# Altium project bio_lamp.PrjPcb
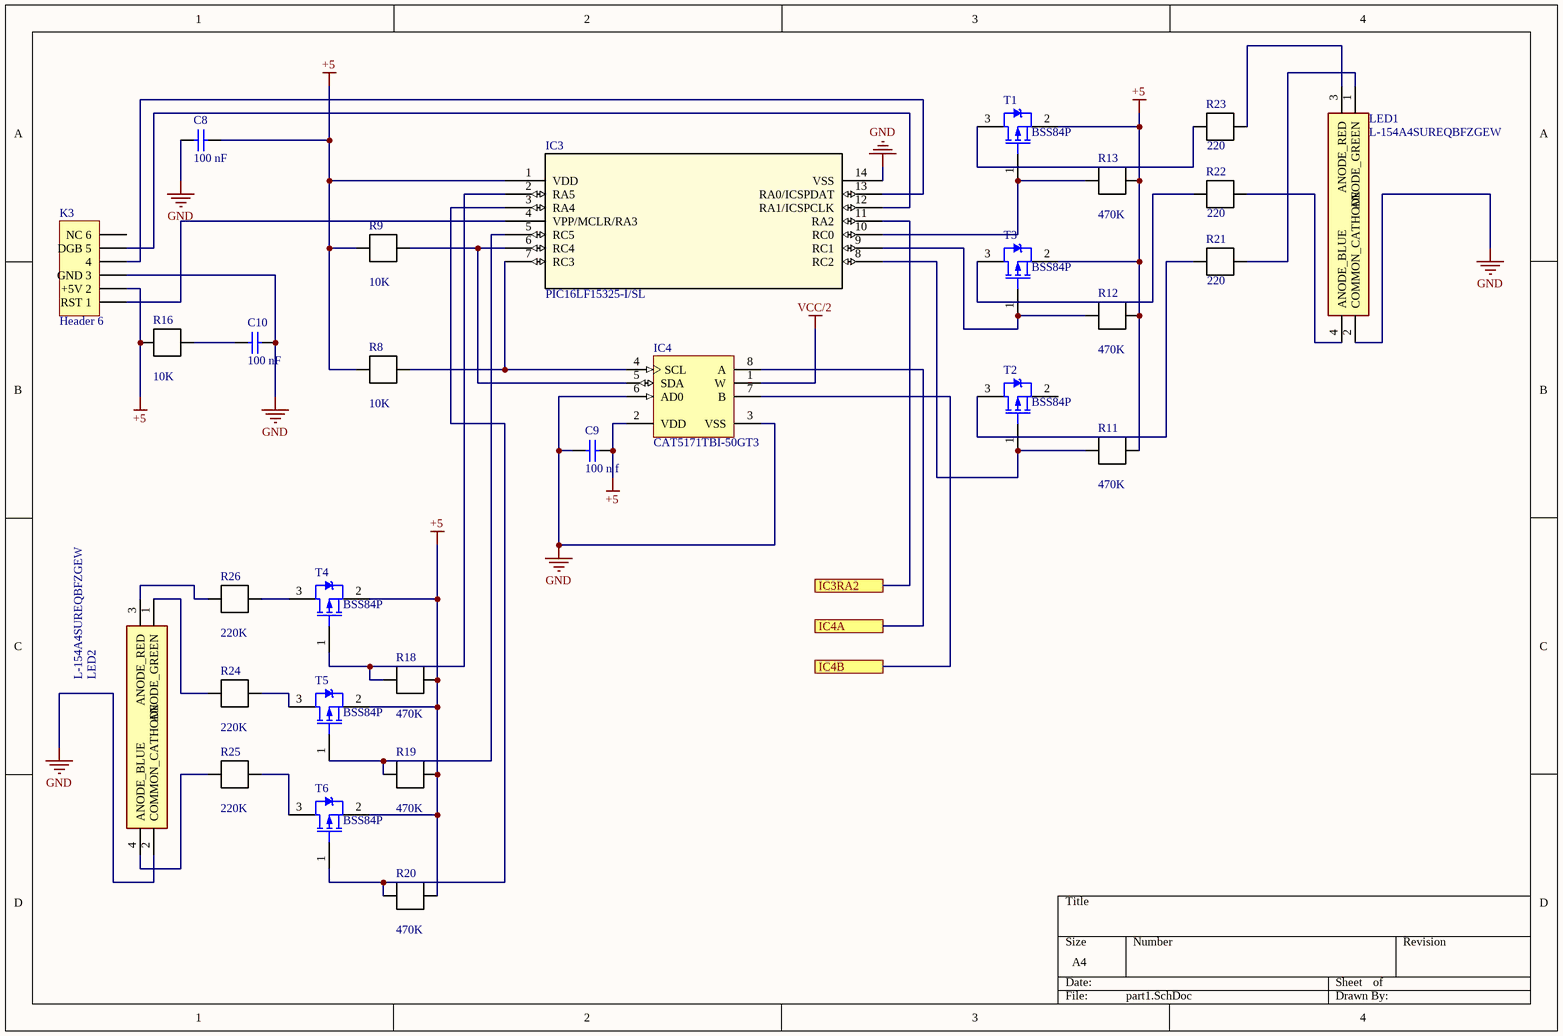
[diagram p0: part1.SchDoc]
2 sheets, 50 parts. Net scope: flat (ports and power ports of the same name join across sheets).
Board file: print1.PcbDoc
Sheets:
  part1.SchDoc
  part2.SchDoc

## Sheet part1.SchDoc
size A4; SheetNumber: 1; SheetTotal: 2

### Parts
C8  100 nF  [CAPC2013X70X45NL10T25]
C9  100 n f  [CAPC2013X70X45NL10T25]
C10  100 nF  [CAPC2013X70X45NL10T25]
IC3  PIC16LF15325-I/SL  [SOIC14_SL_MCH]
IC4  CAT5171TBI-50GT3  [ONSC-SOT23-8-527AK-01_N]
K3  Header 6  [HDR1X6]
LED1  L-154A4SUREQBFZGEW  [L-154A4SUREQBFZGEC]
LED2  L-154A4SUREQBFZGEW  [L-154A4SUREQBFZGEC]
R8  value 10K  [6-0805_M]
R9  value 10K  [6-0805_M]
R11  value 470K  [C1206]
R12  value 470K  [C1206]
R13  value 470K  [C1206]
R16  value 10K  [6-0805_M]
R18  value 470K  [C1206]
R19  value 470K  [C1206]
R20  value 470K  [C1206]
R21  value 220  [C1206]
R22  value 220  [C1206]
R23  value 220  [C1206]
R24  value 220K  [C1206]
R25  value 220K  [C1206]
R26  value 220K  [C1206]
T1  BSS84P  [INF-PG-SOT23_N]
T2  BSS84P  [INF-PG-SOT23_N]
T3  BSS84P  [INF-PG-SOT23_N]
T4  BSS84P  [INF-PG-SOT23_N]
T5  BSS84P  [INF-PG-SOT23_N]
T6  BSS84P  [INF-PG-SOT23_N]

### Ports
IC3RA2, IC4A, IC4B

### Nets
+5: C8.2 C9.2 IC3.1(VDD) IC4.2(VDD) K3.2(+5V_2) R8.1 R9.1 R11.2 R12.2 R13.2 R16.1 R18.2 R19.2 R20.2 T1.2(SOURCE) T3.2(SOURCE) T4.2(SOURCE) T5.2(SOURCE) T6.2(SOURCE)
GND: C8.1 C9.1 C10.2 IC3.14(VSS) IC4.3(VSS) IC4.6(AD0) K3.3(GND_3) LED1.2(COMMON_CATHODE) LED2.2(COMMON_CATHODE)
VCC/2: IC4.1(W)
NetC3_1: IC3.11(RA2) ; port IC3RA2
NetC10_1: C10.1 R16.2
NetIC2_1: IC4.8(A) ; port IC4A
NetIC2_5: IC4.7(B) ; port IC4B
NetIC3_2: IC3.2(RA5) R18.1 T4.1(GATE)
NetIC3_3: IC3.3(RA4) R20.1 T6.1(GATE)
NetIC3_4: IC3.4(VPP/MCLR/RA3) K3.1(RST_1)
NetIC3_5: IC3.5(RC5) R19.1 T5.1(GATE)
NetIC3_6: IC3.6(RC4) IC4.5(SDA) R9.2
NetIC3_7: IC3.7(RC3) IC4.4(SCL) R8.2
NetIC3_8: IC3.8(RC2) R11.1 T2.1(GATE)
NetIC3_9: IC3.9(RC1) R12.1 T3.1(GATE)
NetIC3_10: IC3.10(RC0) R13.1 T1.1(GATE)
NetIC3_12: IC3.12(RA1/ICSPCLK) K3.5(DGB_5)
NetIC3_13: IC3.13(RA0/ICSPDAT) K3.4
NetLED1_1: LED1.1(ANODE_GREEN) R21.2
NetLED1_3: LED1.3(ANODE_RED) R23.2
NetLED1_4: LED1.4(ANODE_BLUE) R22.2
NetLED2_1: LED2.1(ANODE_GREEN) R24.1
NetLED2_3: LED2.3(ANODE_RED) R26.1
NetLED2_4: LED2.4(ANODE_BLUE) R25.1
NetR21_1: R21.1 T2.3(DRAIN)
NetR22_1: R22.1 T3.3(DRAIN)
NetR23_1: R23.1 T1.3(DRAIN)
NetR24_2: R24.2 T5.3(DRAIN)
NetR25_2: R25.2 T6.3(DRAIN)
NetR26_2: R26.2 T4.3(DRAIN)

Not connected (* = marked no-connect by the designer): K3 6(NC_6); T2 2(SOURCE)

### Library data of the parts
C8-C10 = CMP-2007-00889-1: Manufacturer: Murata; Part Number: GRM2165C1H332JA01D
IC3 = PIC16LF15325-I/SL: No Description Available; Vendor: Microchip; Built_By: EMA_Cory; SourceLibrary: Microchip_2020-03-04; Datasheet: http://ww1.microchip.com/downloads/en/DeviceDoc/PIC16-L-F15325-45-Data-Sheet-40001865D.pdf; Manufacturer_Part_Number: PIC16LF15325-I/SL; Copyright: Copyright (C) 2018 Accelerated Designs. All rights reserved; RefDes: RefDes; Type: DEV
IC4 = CMP-1317-00202-1: 256-Position I2C Compatible Digital Potentiometer (POT), -40 to 85 degC, 8-Pin SOT23, Pb-Free, Tape and Reel; Manufacturer: On Semiconductor; # of Pots: 1; VDD Max (V): 5.5; # of Taps: 256; Code_JEDEC: MO-178; RoHS: TRUE; ComponentLink1URL: http://www.onsemi.com/; ComponentLink3URL: http://www.onsemi.com/pub_link/Collateral/527AK.PDF; PackageDescription: 8-Pin Small Outline Transistor, Body 2.9 x 1.6 mm, Pitch 0.65 mm; ComponentLink3Description: Package Specification; PackageReference: SOT23-8-527AK-01; ComponentLink1Description: Manufacturer URL; PartNumber: CAT5171TBI-50GT3; PackageVersion: Rev. A, 03/2009; Packing: Tape and Reel; DatasheetVersion: Rev. 2; Mounting Technology: Surface Mount; ComponentLink2URL: http://www.onsemi.com/pub_link/Collateral/CAT5171-D.PDF; Control Interface: I2C; Type: Potentiometer; ComponentLink2Description: Datasheet
K3 = Header 6: Header, 6-Pin; LatestRevisionDate: 17-Jul-2002; LatestRevisionNote: Re-released for DXP Platform.; Publisher: Altium Limited
LED1 LED2 = L-154A4SUREQBFZGEW: LED; Manufacturer_Name: Kingbright; Datasheet Link: http://www.kingbright.com/attachments/file/psearch/000/00/00/L-154A4SUREQBFZGEW(Ver.11A).pdf; Manufacturer_Part_Number: L-154A4SUREQBFZGEW; Mouser Part Number: N/A; Mouser Price/Stock: https://www.mouser.co.uk/ProductDetail/Kingbright/L-154A4SUREQBFZGEW?qs=2JU0tDl2GZ3s0DU5fkfHGQ%3D%3D
R8 R9 R11-R13 R16 R18-R26 = Res1: Resistor; Published: 8-Jun-2000; LatestRevisionDate: 17-Jul-2002; LatestRevisionNote: Re-released for DXP Platform.; PackageReference: AXIAL-0.3; Publisher: Altium Limited; PackageDescription: Axial Device, Thru-Hole; 2 Leads; 0.3 in Pin Spacing; Supplier 1: RSComponents
T1-T6 = CMP-1099-00028-1: P-Channel SIPMOS Small-Signal-Transistor, -60 V VDS, -0.17 A ID, -55 to 150 degC, PG-SOT23, Reel, Green; Manufacturer: Infineon; VGS(th) (max): -2Â V; VGS(th) (min): -1Â V; VDS (max): -60Â V; Rth: 350Â K/W; Pto t (max): 0.36Â W; ID (max): -0.17Â A; IDpuls (max): -0.68Â A; RDS (on) (max) (@4.5V): 12,000Â mOhm; QG: 1Â nC; Green: TRUE; RDS (on) (max): 8,000Â mOhm; ComponentLink3URL: http://www.infineon.com/dgdl/SOT23-Package_Overview.pdf?folderId=db3a30431936bc4b0119532290053c66&fileId=db3a30431936bc4b0119533468123c85; ComponentLink3Description: Package Specification; Packing: Reel; PartNumber: BSS84P; ComponentLink2Description: Datasheet; Mounting Technology: Surface Mount; ComponentLink2URL: http://www.infineon.com/dgdl/BSS84P_Rev2.7%5B1%5D.pdf?folderId=db3a304314dca38901154a72e3951a65&fileId=db3a304330f68606013118ac7a9b4549; PackageReference: PG-SOT23; ComponentLink1URL: http://www.infineon.com/; PackageVersion: Apr-08; ComponentLink1Description: Manufacturer URL; PackageDescription: 3-Pin Small Outline Transistor Package, 2.9 x 1.3 mm Body, 0.95 mm Pitch; Halogen-free: TRUE; DatasheetVersion: Rev. 2.7

## Sheet part2.SchDoc
size A4; SheetNumber: 2; SheetTotal: 2
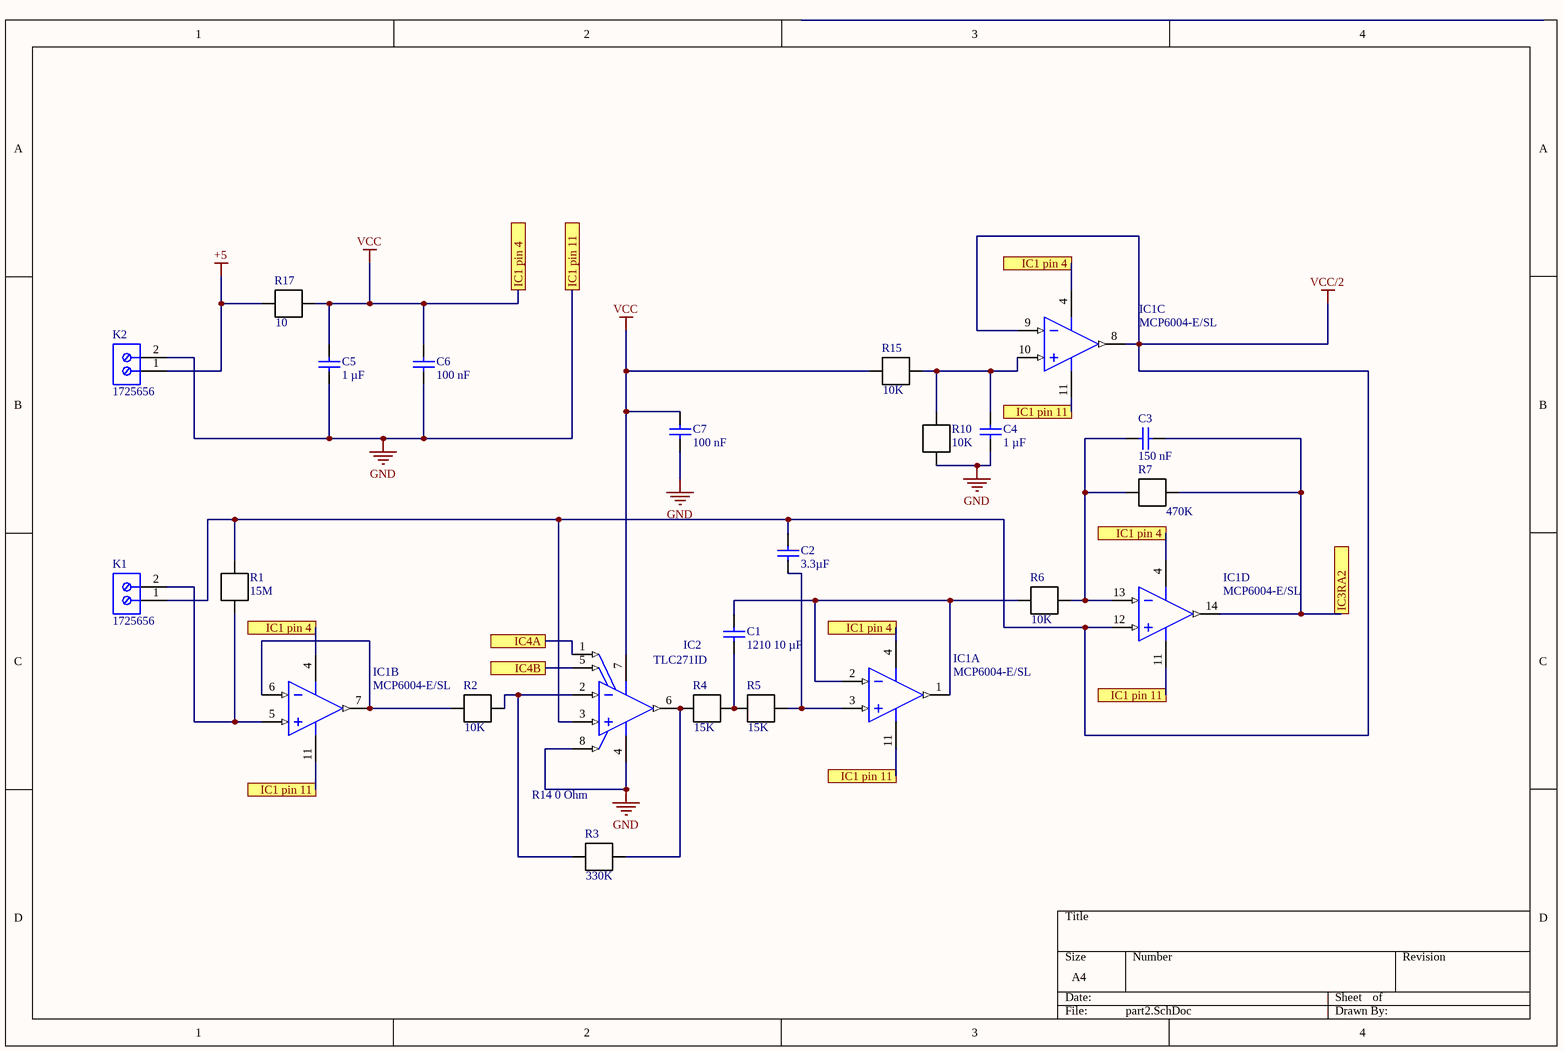
[diagram p1: part2.SchDoc]

### Parts
C1  1210 10 µF  [CAPC3225X279X50LL20T25]
C2  3.3µF  [CAPC1210(3225)280_N]
C3  150 nF  [CAPC2013X70X45NL10T25]
C4  1 µF  [CAPC2013X70X45NL10T25]
C5  1 µF  [CAPC2013X70X45NL10T25]
C6  100 nF  [CAPC2013X70X45NL10T25]
C7  100 nF  [CAPC2013X70X45NL10T25]
IC1  MCP6004-E/SL  [SOIC-SL14_M]  (parts A,B,C,D of 4)
IC2  TLC271ID  [D0008A_L]
K1  1725656  [PHOE-1725656-2]
K2  1725656  [PHOE-1725656-2]
R1  value 15M  [6-0805_M]
R2  value 10K  [6-0805_M]
R3  value 330K  [C1206]
R4  value 15K  [C1206]
R5  value 15K  [C1206]
R6  value 10K  [6-0805_M]
R7  value 470K  [C1206]
R10  value 10K  [6-0805_M]
R15  value 10K  [6-0805_M]
R17  value 10  [6-0805_M]

### Ports
IC1 pin 4, IC1 pin 11, IC3RA2, IC4A, IC4B

### Nets
+5: K2.1 R17.1
GND: C4.1 C5.1 C6.1 C7.1 IC1.11(VSS) IC2.4(GND) IC2.8(BIAS_SELECT) K2.2 R10.1 ; port IC1 pin 11
VCC: C5.2 C6.2 C7.2 IC1.4(VDD) IC2.7(VDD) R15.1 R17.2 ; port IC1 pin 4
VCC/2: C2.2 IC1.8(VOUTC) IC1.9(VINC-) IC1.12(VIND+) IC2.3(IN+) K1.1 R1.2
NetC1_1: C1.1 R4.2 R5.1
NetC1_2: C1.2 IC1.1(VOUTA) IC1.2(VINA-) R6.1
NetC2_1: C2.1 IC1.3(VINA+) R5.2
NetC3_1: C3.1 IC1.14(VOUTD) R7.2 ; port IC3RA2
NetC3_2: C3.2 IC1.13(VIND-) R6.2 R7.1
NetC4_2: C4.2 IC1.10(VINC+) R10.2 R15.2
NetIC1_5: IC1.5(VINB+) K1.2 R1.1
NetIC1_6: IC1.6(VINB-) IC1.7(VOUTB) R2.1
NetIC2_1: IC2.1(OFFSET_N1) ; port IC4A
NetIC2_2: IC2.2(IN-) R2.2 R3.1
NetIC2_5: IC2.5(OFFSET_N2) ; port IC4B
NetIC2_6: IC2.6(OUT) R3.2 R4.1

### Notes on the sheet
- R14 0 Ohm

### Library data of the parts
C1 = CMP-2000-05477-1: Chip Capacitor, 10 uF, +/- 10%, 25 V, -55 to 85 degC, 1210 (3225 Metric), RoHS, Tape and Reel; Manufacturer: AVX; Product Training Modules: ComponentSolutionsforSmartMeterApplications; Capacitance: 10µF; Catalog Drawings: AT2A_1210_2.79; Voltage - Rated: 25V; Other Names: 478-1627-6; Online Catalog: X5RDielectric(D); Temperature Coefficient: X5R; Package Reference: 1210; Lead Style: -; Manufacturer URL: http://www.avx.com/; Datasheet Version: 05/2016; Ratings: -; Mounting Technology: SurfaceMount; Datasheet URL: http://datasheets.avx.com/cx5r.pdf; Package Description: 2-Pin Surface Mount Device, Body 3.2 x 2.5 mm; Applications: GeneralPurpose; Features: -; Tolerance: ±10%; Package / Case: 1210(3225Metric); Lead Spacing: -; Series: -; Mounting Type: SurfaceMount,MLCC; Family: CeramicCapacitors; Standard Package: 1; Category: Capacitors; Packaging: Digi-Reel®; Thickness (Max): 0.110"(2.79mm); Operating Temperature: -55°C~85°C; Size / Dimension: 0.126"Lx0.098"W(3.20mmx2.50mm); Height - Seated (Max): -
C2 = CMP-1038-02104-1: CAP 2.2uF 100V ±10% 1210 (3225 Metric) Thickness 2.8mm SMD; Case-Metric: 3225; Tolerance: Â±10%; Case-EIA: 1210; Rated Voltage: 100 V; Value: 3.3µF; Technology: SMT; Max Thickness: 2.8 mm
C3-C7 = CMP-2007-00889-1: as C8 on sheet part1
IC1 = CMP-0187-00279-2: 1 MHz, Low-Power Operational Amplifier, 14-Pin SOIC, Extended Temperature; PackageVersion: revBB, Aug-2009; ComponentLink3URL: http://www.microchip.com/stellent/groups/techpub_sg/documents/packagingspec/en012702.pdf; ComponentLink1URL: http://www.microchip.com/; Code_IPC: SOIC127P600-14; ComponentLink1Description: Manufacturer URL; PackageDescription: 14-Lead Plastic Small Outline (SL) - Narrow, 3.90mm Body [SOIC]; RevisionNote: URLs added.; ComponentLink2Description: Datasheet; ComponentLink3Description: Package Specification; DatasheetVersion: revJ, Nov-2009; ComponentLink2URL: http://ww1.microchip.com/downloads/en/DeviceDoc/21733j.pdf; Code_JEDEC: MS-012-AB; PackageReference: SOIC-SL14
IC2 = CMP-0017-00249-2: LinCMOS(TM) Programmable Low-Power Operational Amplifier, 4 to 16 V, -40 to 85 degC, 8-pin SOIC (D8), Green (RoHS & no Sb/Br); Manufacturer: Texas Instruments; Sub Family: General Purpose Amplifier; Slew Rate(Typ)(V/us): 3.6; Total Supply Voltage(Max)(+5V is 5, +/-5V is 10): 16; Iq per channel(Max)(mA): 1.6; Vio (25C)(Max)(mV): 10; Total Supply Voltage(Min)(+5V is 5, +/-5V is 10): 4; GBW(Typ)(MHz): 1.7; Number of Channels: 1; IIB(Max)(pA): 60; CMRR(Min)(dB): 65; Vn at 1kHz(Typ)(nV/rtHz): 25; Rating: Military; Offset Drift(Typ)(uV/C): 1.8; PackageDescription: 8-Pin Plastic Small Outline, Body 4.9 x 3.9 mm, Pitch 1.27 mm; PackageReference: D0008A; PackageVersion: 4040047-3/M, 06/2011; ComponentLink1Description: Manufacturer URL; ComponentLink3URL: http://www.ti.com/litv/pdf/msoi002j; ComponentLink2URL: http://www.ti.com/lit/ds/symlink/tlc271.pdf; Eco-Plan: Green (RoHS & no Sb/Br); DatasheetVersion: SLOS090D; ComponentLink3Description: Package Specification; Code_JEDEC: MS-012; PartNumber: TLC271ID; ComponentLink1URL: http://www.ti.com/; Mounting Technology: Surface Mount; ComponentLink2Description: Datasheet
K1 K2 = CMP-2000-05299-1: Male Header, Pitch 2.54 mm, 1 x 2 Position, Height 9 mm, Tail Length 3.5 mm; Manufacturer: Phoenix Contact; Number of contacts: 2; Content: 250pc(s); Pitch: 2.54mm; Industrial packaging: Yes; Colour: Green; Manufacturer part No.: 1725656; Type: MPT0,5/2-2,54; Datasheet URL: http://datasheet.octopart.com/1725656-Phoenix-Contact-datasheet-5302866.pdf; Manufacturer URL: http://www.phoenixcontact.com/; Datasheet Version: Apr-08
R1-R7 R10 R15 R17 = Res1: Resistor; Published: 8-Jun-2000; LatestRevisionDate: 17-Jul-2002; LatestRevisionNote: Re-released for DXP Platform.; PackageReference: AXIAL-0.3; Publisher: Altium Limited; PackageDescription: Axial Device, Thru-Hole; 2 Leads; 0.3 in Pin Spacing; Supplier 1: RSComponents

## Nets that join several sheets
+5: part1 (19 pins), part2 (K2.1 R17.1)
GND: part1 (9 pins), part2 (9 pins)
VCC/2: part1 (IC4.1), part2 (7 pins)
NetC3_1: part1 (IC3.11), part2 (C3.1 IC1.14 R7.2)
NetIC2_1: part1 (IC4.8), part2 (IC2.1)
NetIC2_5: part1 (IC4.7), part2 (IC2.5)